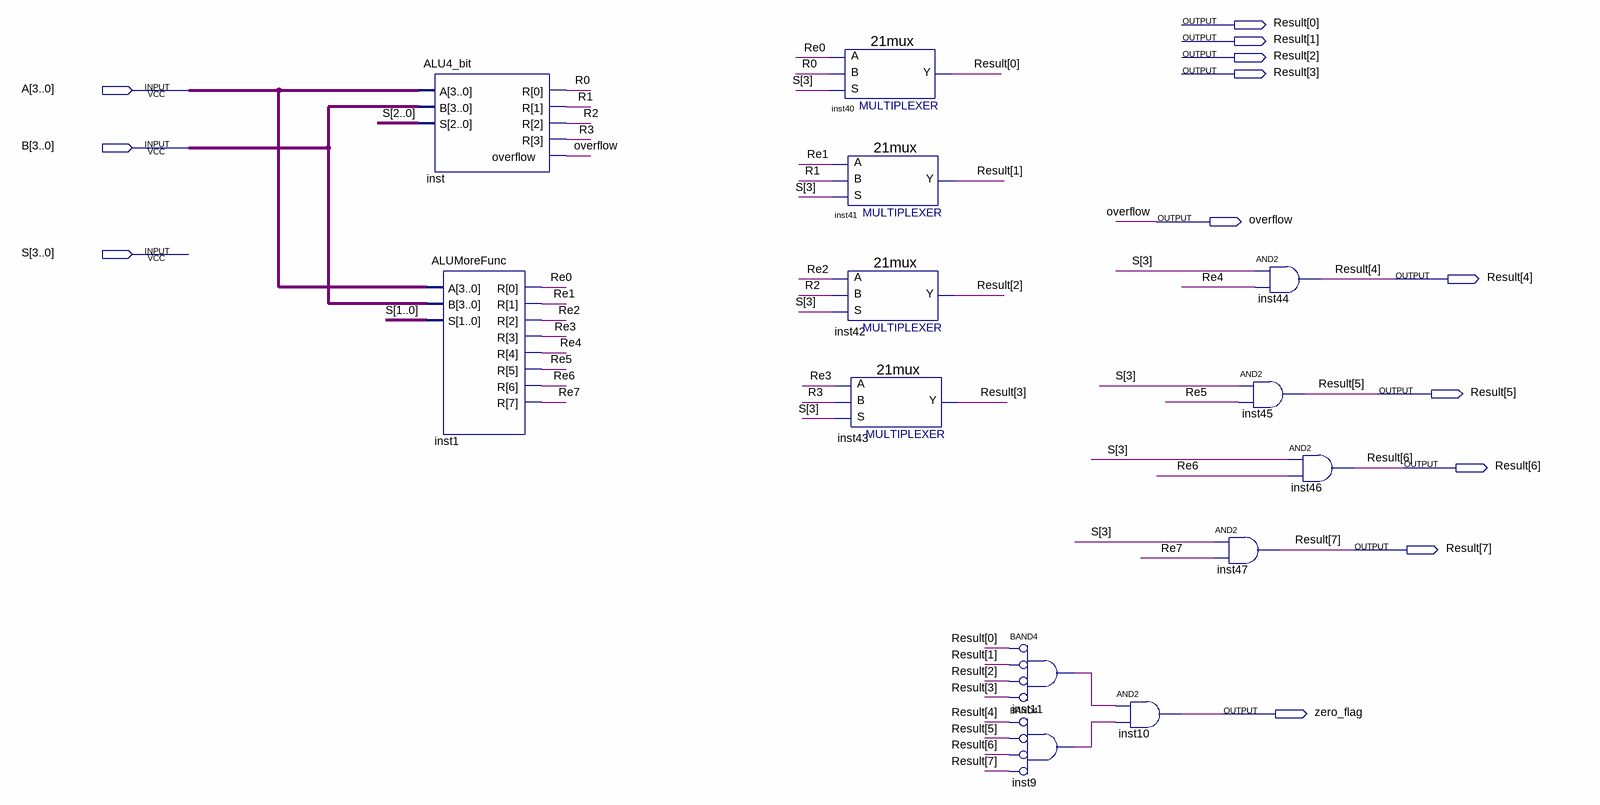
[diagram p0: schematic sheet]
// Quartus schematic ALU_complete.bdf as structural Verilog: 13 symbols, 13 pins
module ALU_complete (
  input  [3:0] A,
  input  [3:0] B,
  input  [3:0] S,
  output [7:0] Result,
  output overflow,
  output zero_flag
);

  wire inst9_out, inst11_out, R0, R1, R2, R3, Re0, Re1, Re2, Re3, Re4, Re5, Re6, Re7;

  ALU4_bit inst (.A(A), .B(B), .S(S[2:0]), .R({R3, R2, R1, R0}), .overflow(overflow));
  ALUMoreFunc inst1 (.A(A), .B(B), .S(S[1:0]), .R({Re7, Re6, Re5, Re4, Re3, Re2, Re1, Re0}));
  \21mux  inst40 (.S(S[3]), .B(R0), .A(Re0), .Y(Result[0]));
  \21mux  inst41 (.S(S[3]), .B(R1), .A(Re1), .Y(Result[1]));
  \21mux  inst42 (.S(S[3]), .B(R2), .A(Re2), .Y(Result[2]));
  \21mux  inst43 (.S(S[3]), .B(R3), .A(Re3), .Y(Result[3]));
  and inst11 (inst11_out, ~Result[0], ~Result[1], ~Result[2], ~Result[3]);  // BAND4
  and inst9 (inst9_out, ~Result[4], ~Result[5], ~Result[6], ~Result[7]);  // BAND4
  and inst10 (zero_flag, inst11_out, inst9_out);
  and inst44 (Result[4], S[3], Re4);
  and inst45 (Result[5], S[3], Re5);
  and inst47 (Result[7], S[3], Re7);
  and inst46 (Result[6], S[3], Re6);
endmodule
